# Altium schematic sheet Models.SchDoc
size A4
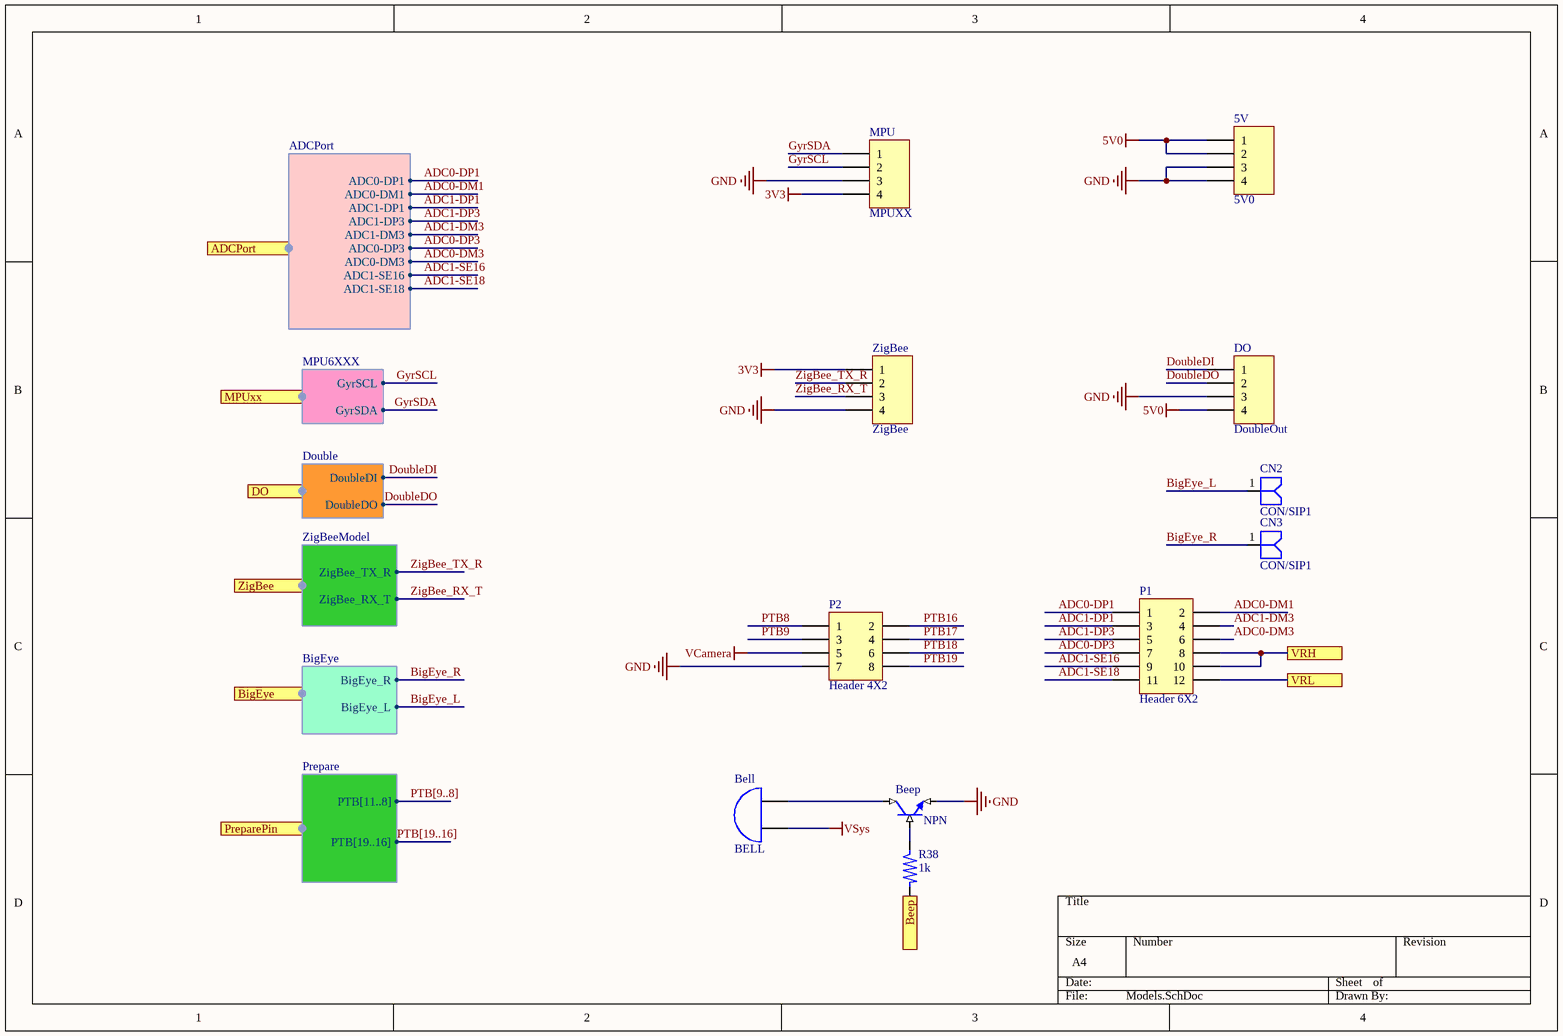
[diagram p0: Models.SchDoc]

## Parts
5V  5V0  [HDR1X4]
Beep  NPN  [SOT23-3]
Bell  BELL  [BEEP]
CN2  CON/SIP1  [HDR1X1]
CN3  CON/SIP1  [HDR1X1]
DO  DoubleOut  [HDR1X4]
MPU  MPUXX  [HDR1X4]
P1  Header 6X2  [HDR2X6]
P2  Header 4X2  [HDR2X4]
R38  1k  [R0603]
ZigBee  ZigBee  [HDR1X4]

## Ports
ADCPort (harness ADCPort), Beep (in), BigEye (harness BigEye), DO (harness Double), MPUxx (harness MPU6XXX), PreparePin (harness Prepare), VRH, VRL, ZigBee (harness ZigBeeModel)

## Harnesses
MPU6XXX: GyrSCL, GyrSDA
ZigBeeModel: ZigBee_TX_R, ZigBee_RX_T
BigEye: BigEye_R, BigEye_L
Double: DoubleDI, DoubleDO
ADCPort: ADC0-DP1, ADC0-DM1, ADC1-DP1, ADC1-DP3, ADC1-DM3, ADC0-DP3, ADC0-DM3, ADC1-SE16, ADC1-SE18
Prepare: PTB[11..8], PTB[19..16]

## Nets
3V3: MPU.4 ZigBee.1
5V0: 5V.1 5V.2 DO.4
GND: 5V.3 5V.4 Beep.2(E) DO.3 MPU.3 P2.7 ZigBee.4
VCamera: P2.5
VSys: Bell.1(A)
ADC0-DM1: P1.2 ; port ADCPort.ADC0-DM1
ADC0-DM3: P1.6 ; port ADCPort.ADC0-DM3
ADC0-DP1: P1.1 ; port ADCPort.ADC0-DP1
ADC0-DP3: P1.7 ; port ADCPort.ADC0-DP3
ADC1-DM3: P1.4 ; port ADCPort.ADC1-DM3
ADC1-DP1: P1.3 ; port ADCPort.ADC1-DP1
ADC1-DP3: P1.5 ; port ADCPort.ADC1-DP3
ADC1-SE16: P1.9 ; port ADCPort.ADC1-SE16
ADC1-SE18: P1.11 ; port ADCPort.ADC1-SE18
Beep: R38.1 ; port Beep
BigEye_L: CN2.1 ; port BigEye.BigEye_L
BigEye_R: CN3.1 ; port BigEye.BigEye_R
DoubleDI: DO.1 ; port DO.DoubleDI
DoubleDO: DO.2 ; port DO.DoubleDO
GyrSCL: MPU.2 ; port MPUxx.GyrSCL
GyrSDA: MPU.1 ; port MPUxx.GyrSDA
PTB8: P2.1
PTB9: P2.3
PTB16: P2.2
PTB17: P2.4
PTB18: P2.6
PTB19: P2.8
VRH: P1.8 P1.10 ; port VRH
VRL: P1.12 ; port VRL
ZigBee_RX_T: ZigBee.3 ; port ZigBee.ZigBee_RX_T
ZigBee_TX_R: ZigBee.2 ; port ZigBee.ZigBee_TX_R
NetBeep_1: Beep.1(B) R38.2
NetBeep_3: Beep.3(C) Bell.2(B)

## Buses and harness runs
bus PTB[9..8]
bus PTB[19..16]

## Library data of the parts
5V DO MPU ZigBee = Header 4: Header, 4-Pin; LatestRevisionDate: 17-Jul-2002; LatestRevisionNote: Re-released for DXP Platform.; Publisher: Altium Limited
Beep = NPN: triode
Bell = BELL: 蜂鸣器
P1 = Header 6X2: Header, 6-Pin, Dual row; LatestRevisionDate: 17-Jul-2002; LatestRevisionNote: Re-released for DXP Platform.; Publisher: Altium Limited
P2 = Header 4X2: Header, 4-Pin, Dual row; LatestRevisionDate: 17-Jul-2002; LatestRevisionNote: Re-released for DXP Platform.; Publisher: Altium Limited
R38 = Resistor: 电阻